# EAGLE design ps2 (EAGLE 9.6.2)
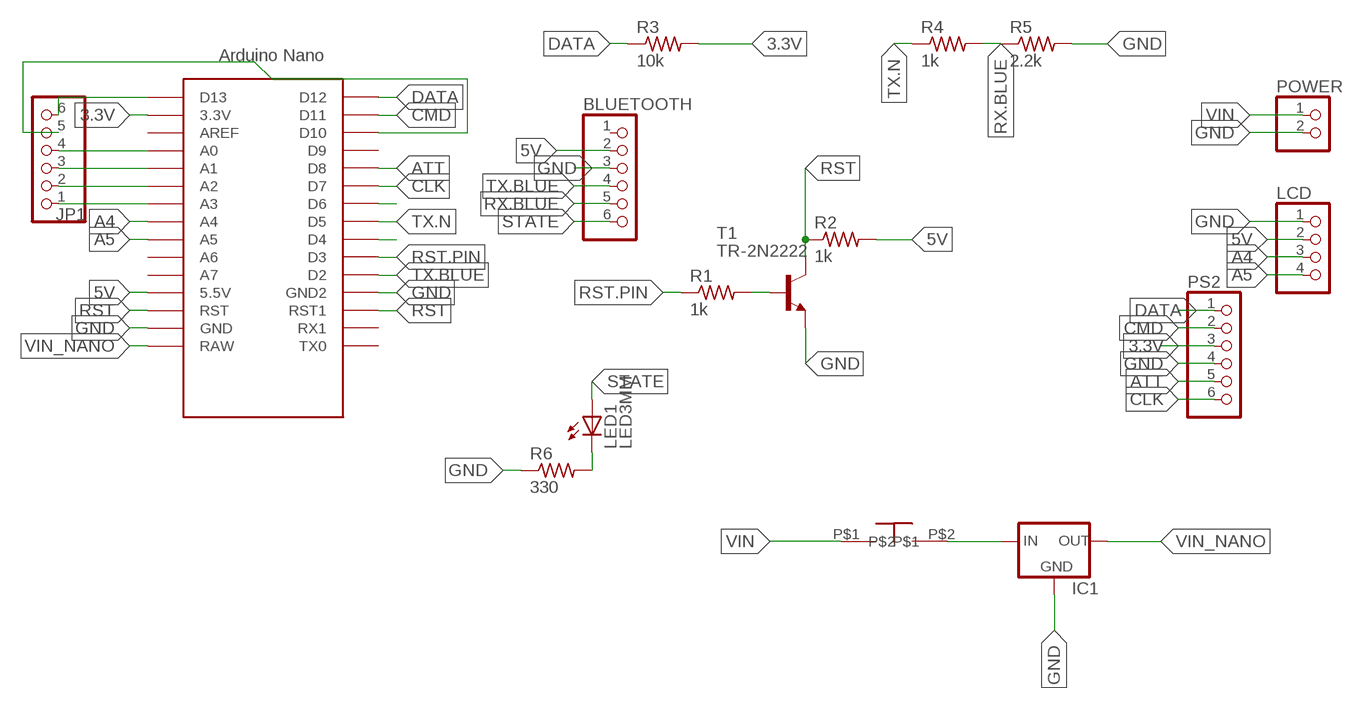
[diagram p0: schematic, sheet 1]

## Parts
BLUETOOTH  PINHD-1X6  [1X06]
IC1  78XXS  [78XXS]
JP1  PINHD-1X6  [1X06]
LCD  PINHD-1X4  [1X04]
LED1  LED3MM  [LED3MM]
POWER  PINHD-1X2  [1X02]
PS2  PINHD-1X6  [1X06]
R1  1k  RES-5  [0204/5]
R2  1k  RES-5  [0204/5]
R3  10k  RES-5  [0204/5]
R4  1k  RES-5  [0204/5]
R5  2.2k  RES-5  [0204/5]
R6  330  RES-5  [0204/5]
T1  TR-2N2222  [TO18]
U$1  ARDUINO_NANO  [NANO]
U$2  SWITCH_2  [ON_OFF]

## Nets
3.3V: PS2.3 R3.2 U$1.3.3V
5V: BLUETOOTH.2 LCD.2 R2.2 U$1.5V(5.5V)
A4: LCD.3 U$1.A4
A5: LCD.4 U$1.A5
ATT: PS2.5 U$1.D8
CLK: PS2.6 U$1.D7
CMD: PS2.2 U$1.D11
DATA: PS2.1 R3.1 U$1.D12
GND: BLUETOOTH.3 IC1.GND LCD.1 POWER.2 PS2.4 R5.2 R6.1 T1.1(E) U$1.GND U$1.GND1(GND2)
N$1: R1.2 T1.2(B)
N$2: JP1.1 U$1.A3
N$3: LED1.K(C) R6.2
N$4: JP1.2 U$1.A2
N$5: JP1.3 U$1.A1
N$6: JP1.4 U$1.A0
N$7: JP1.6 U$1.D13
N$8: JP1.5 U$1.D10
N$9: IC1.IN U$2.P$2
N$12: U$1.D6
N$14: U$1.D4
RST: R2.1 T1.3(C) U$1.RST U$1.RST1
RST.PIN: R1.1 U$1.D3
RX.BLUE: BLUETOOTH.5 R4.2 R5.1
STATE: BLUETOOTH.6 LED1.A
TX.BLUE: BLUETOOTH.4 U$1.D2
TX.N: R4.1 U$1.D5
VIN: POWER.1 U$2.P$1
VIN_NANO: IC1.OUT U$1.RAW
Unconnected: BLUETOOTH.1 U$1.A6 U$1.A7 U$1.AREF U$1.D9 U$1.RX1 U$1.TX0

## Library data of the parts
BLUETOOTH JP1 PS2 = MIA_LIBRARY-2-2-2:PINHD-1X6: PIN HEADER
IC1 = MIA_LIBRARY-2-2-2:78XXS: VOLTAGE REGULATOR
LCD = MIA_LIBRARY-2-2-2:PINHD-1X4: PIN HEADER
LED1 = MIA_LIBRARY-2-2-2:LED3MM
POWER = MIA_LIBRARY-2-2-2:PINHD-1X2: PIN HEADER
R1-R6 = MIA_LIBRARY-2-2-2:RES-5
T1 = MIA_LIBRARY-2-2-2:TR-2N2222: NPN TRANSISTOR
U$1 = MIA_LIBRARY-2-2-2:ARDUINO_NANO: Arduino Nano
U$2 = MIA_LIBRARY-2-2-2:SWITCH_2

## Board
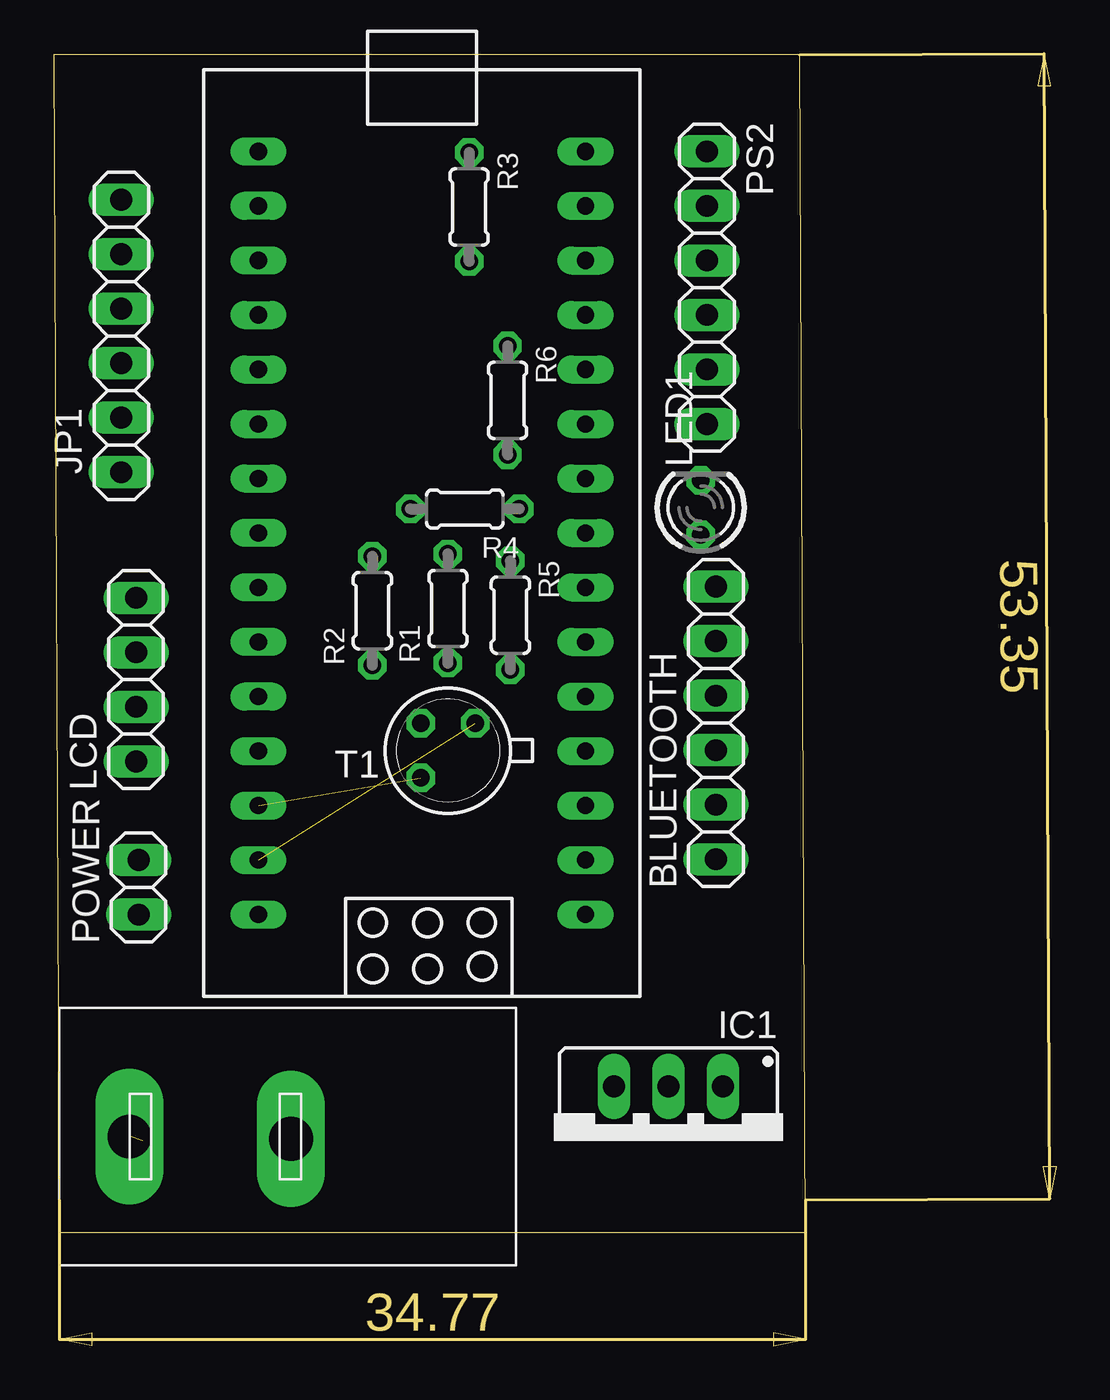
[diagram p1: board, top side]
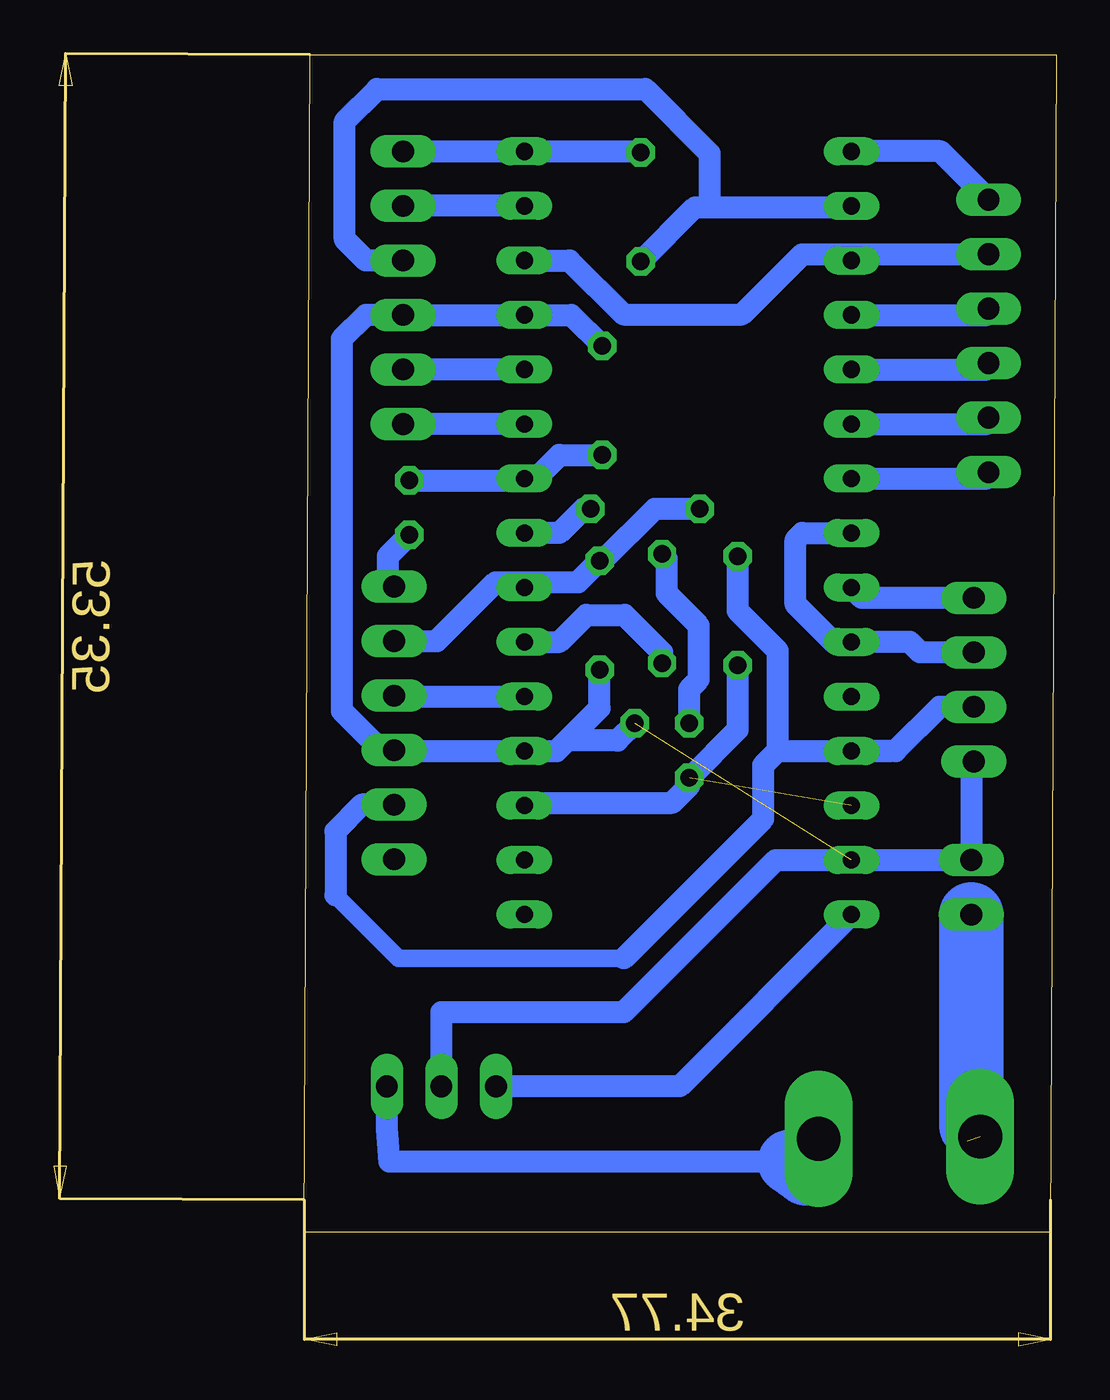
[diagram p2: board, bottom side, seen from below]

Size 35.04 x 54.85 mm. Coordinates in mm from the lower left corner, seen from the top.
Outline: 0.27,0 35.04,0 34.77,54.85 0,54.85 0.27,0
Copper layers (1*16): Top 0.035mm / dielectric 1.5mm / Bottom 0.035mm
Design rules "default": minimum track width 6mil, minimum drill 0.35mm, track to track 6mil, track to pad 6mil, pad to pad 6mil, via to via 6mil, smd to smd 6mil, copper to edge 40mil, drill to drill 6mil, minimum pad ring 10mil, minimum via ring 8mil, stop-mask expansion 4mil, vias tented up to drill 0mil, thermal gap 10mil

### Footprints (pad centres in the part's own frame; a part is rotated, then mirrored left to right if it is on the bottom)
1X06 = drill 1.016 long: 1 -6.35,0; 2 -3.81,0; 3 -1.27,0; 4 1.27,0; 5 3.81,0; 6 6.35,0
78XXS = drill 1.016 long: GND 0,-2.54; IN -2.54,-2.54; OUT 2.54,-2.54
1X04 = drill 1.016 long: 1 -3.81,0; 2 -1.27,0; 3 1.27,0; 4 3.81,0
LED3MM = drill 0.813 octagon: A -1.27,0; K 1.27,0
1X02 = drill 1.016 long: 1 -1.27,0; 2 1.27,0
0204/5 = drill 0.813 octagon: 1 -2.54,0; 2 2.54,0
TO18 = drill 0.813 octagon: 1 -1.27,-1.27; 2 1.27,-1.27; 3 1.27,1.27
NANO = drill 0.8 long: 3.3V -10.16,24.13; 5V -10.16,-1.27; A0 -10.16,19.05; A1 -10.16,16.51; A2 -10.16,13.97; A3 -10.16,11.43; A4 -10.16,8.89; A5 -10.16,6.35; A6 -10.16,3.81; A7 -10.16,1.27; AREF -10.16,21.59; D2 5.08,1.27; D3 5.08,3.81; D4 5.08,6.35; D5 5.08,8.89; D6 5.08,11.43; D7 5.08,13.97; D8 5.08,16.51; D9 5.08,19.05; D10 5.08,21.59; D11 5.08,24.13; D12 5.08,26.67; D13 -10.16,26.67; GND -10.16,-6.35; GND1 5.08,-1.27; RAW -10.16,-8.89; RST -10.16,-3.81; RST1 5.08,-3.81; RX1 5.08,-6.35; TX0 5.08,-8.89
ON_OFF = drill 2.032 pad 3.175 long: P$1 3.27,5.952; P$2 10.795,5.842

### Placement (x,y rotation side)
BLUETOOTH  30.86,23.72 90 top
IC1  28.65,4.25 180 top
JP1  3.15,41.75 90 top
LCD  3.84,25.74 90 top
LED1  30.15,33.75 90 top
POWER  3.96,16.06 90 top
PS2  30.44,44 270 top
R1  18.37,29.05 90 top
R2  14.85,28.95 90 top
R3  19.36,47.76 270 top
R4  19.16,33.69 180 top
R5  21.28,28.74 270 top
R6  21.15,38.75 270 top
T1  18.37,22.43 180 top
U$1  19.7,23.68 0 top
U$2  0.27,-1.5 0 top

### Tracks (layer width: path | path; a pad name or v marks a point on that pad's centre or on a via)
3.3V
  Bottom 1.016: R3.2 16.83,47.75 16.15,47.75 | U$1.3.3V 9.6,47.75 16.15,47.75 | PS2.3 32.17,45.27 33.15,46.25 33.15,51.75 31.65,53.25 19.15,53.25 16.15,50.25 16.15,47.75
5V
  Bottom 0.813: 33.59,15.69 30.65,12.75 20.15,12.75
  Bottom 1.016: LCD.2 5.43,24.47 7.49,22.41 U$1.5V | BLUETOOTH.2 32.36,19.91 33.59,18.69 33.59,15.69 | U$1.5V 7.77,22.41 | 12.99,22.41 U$1.5V | 12.99,22.41 13.65,21.75 13.65,19.25 20.15,12.75 | R2.2 14.85,28.95 12.99,27.09 12.99,22.41
A4
  Bottom 1.016: LCD.3 6.34,27.01 6.84,27.51 10.41,27.51 12.15,29.25 12.15,32.25 11.83,32.57 U$1.A4
A5
  Bottom 1.016: LCD.4 9.06,29.55 U$1.A5
ATT
  Bottom 1.016: 28.71,40.19 PS2.5 U$1.D8
CLK
  Bottom 1.016: 28.25,37.65 PS2.6 U$1.D7
CMD
  Bottom 1.016: U$1.D11 PS2.2
DATA
  Bottom 1.016: PS2.1 U$1.D12 19.41,50.35 R3.1
GND  (1 unrouted)
  Bottom 1.016: LCD.1 3.96,21.81 POWER.2 U$1.GND 13.07,17.33 20.15,10.25 28.65,10.25 IC1.GND | 22.8,22.9 23.28,22.41 U$1.GND1 30.82,22.41 BLUETOOTH.3 31.08,22.67 31.67,22.67 33.29,24.3 33.29,41.61 32.17,42.73 PS2.4 22.59,42.73 R6.1 | 22.8,22.9 21.28,24.41 R5.2 | T1.1 20.45,22.9 22.8,22.9
N$1
  Bottom 1.016: T1.2 17.1,25.3 16.65,25.75 16.65,28.25 18.15,29.75 18.15,31.37 R1.2
N$2
  Bottom 1.016: U$1.A3 3.22,35.11 JP1.1
N$3
  Bottom 1.016: LED1.K 24.34,35.02 23.15,36.21 R6.2
N$4
  Bottom 1.016: U$1.A2 3.22,37.65 JP1.2
N$5
  Bottom 1.016: U$1.A1 3.22,40.19 JP1.3
N$6
  Bottom 1.016: U$1.A0 3.22,42.73 JP1.4
N$7
  Bottom 1.016: JP1.6 5.4,50.35 U$1.D13
N$8
  Bottom 1.016: U$1.D10 22.67,45.27 20.15,42.75 14.65,42.75 11.84,45.56 JP1.5
N$9
  Bottom 1.016: 12.41,3.28 31.08,3.28 31.19,4.82 IC1.IN
  Bottom 3: U$2.P$2 11.06,3.34 11.67,2.74 12.41,3.28
RST  (1 unrouted)
  Bottom 1.016: U$1.RST1 24.65,20 17.9,20 17.1,20.8 T1.3 14.85,23.41 R2.1
RST.PIN
  Bottom 1.016: R1.1 18.37,27.01 20.11,28.75 21.89,28.75 23.15,27.49 U$1.D3
RX.BLUE
  Bottom 1.016: 30.67,27.72 BLUETOOTH.5 28.87,27.53 26.12,30.28 22.28,30.28 R5.1 21.12,31.28 18.71,33.69 R4.2
STATE
  Bottom 1.016: LED1.A 31.15,31.48 31.15,30.36 BLUETOOTH.6
TX.BLUE
  Bottom 1.016: BLUETOOTH.4 30.82,24.95 U$1.D2
TX.N
  Bottom 1.016: U$1.D5 23.15,32.57 22.03,33.69 R4.1
VIN  (1 unrouted)
  Bottom 1.016: 3.96,4.94 4.15,4.75 4.15,4.25
  Bottom 3: POWER.1 3.96,4.94
VIN_NANO
  Bottom 1.016: U$1.RAW 17.54,6.79 IC1.OUT